# Altium schematic sheet MCU & Peripherals.SchDoc: STM32 Blue Pill
size A3; ApprovedBy: Bui Quoc Bao; SheetNumber: 3; SheetTotal: 4; SPICEModelCacheVQOZSIKY: <root> / <DocumentId>VQOZSIKY</DocumentId> / <CacheFrame Number="0"> / <Model Name="0805_885012207072_100nf" Kind="CKT"> / <Text>******* / .subckt 0805_885012207072_100nF 1 2 / Rser 1 3 0.0172819633028 / Lser 2 4 0.00000000035 / C1 3 4 0.0000001 / Rpar 3 4 5000000000 / .ends 0805_885012207072_100nF</Text> / </Model> / </CacheFrame> / </root>
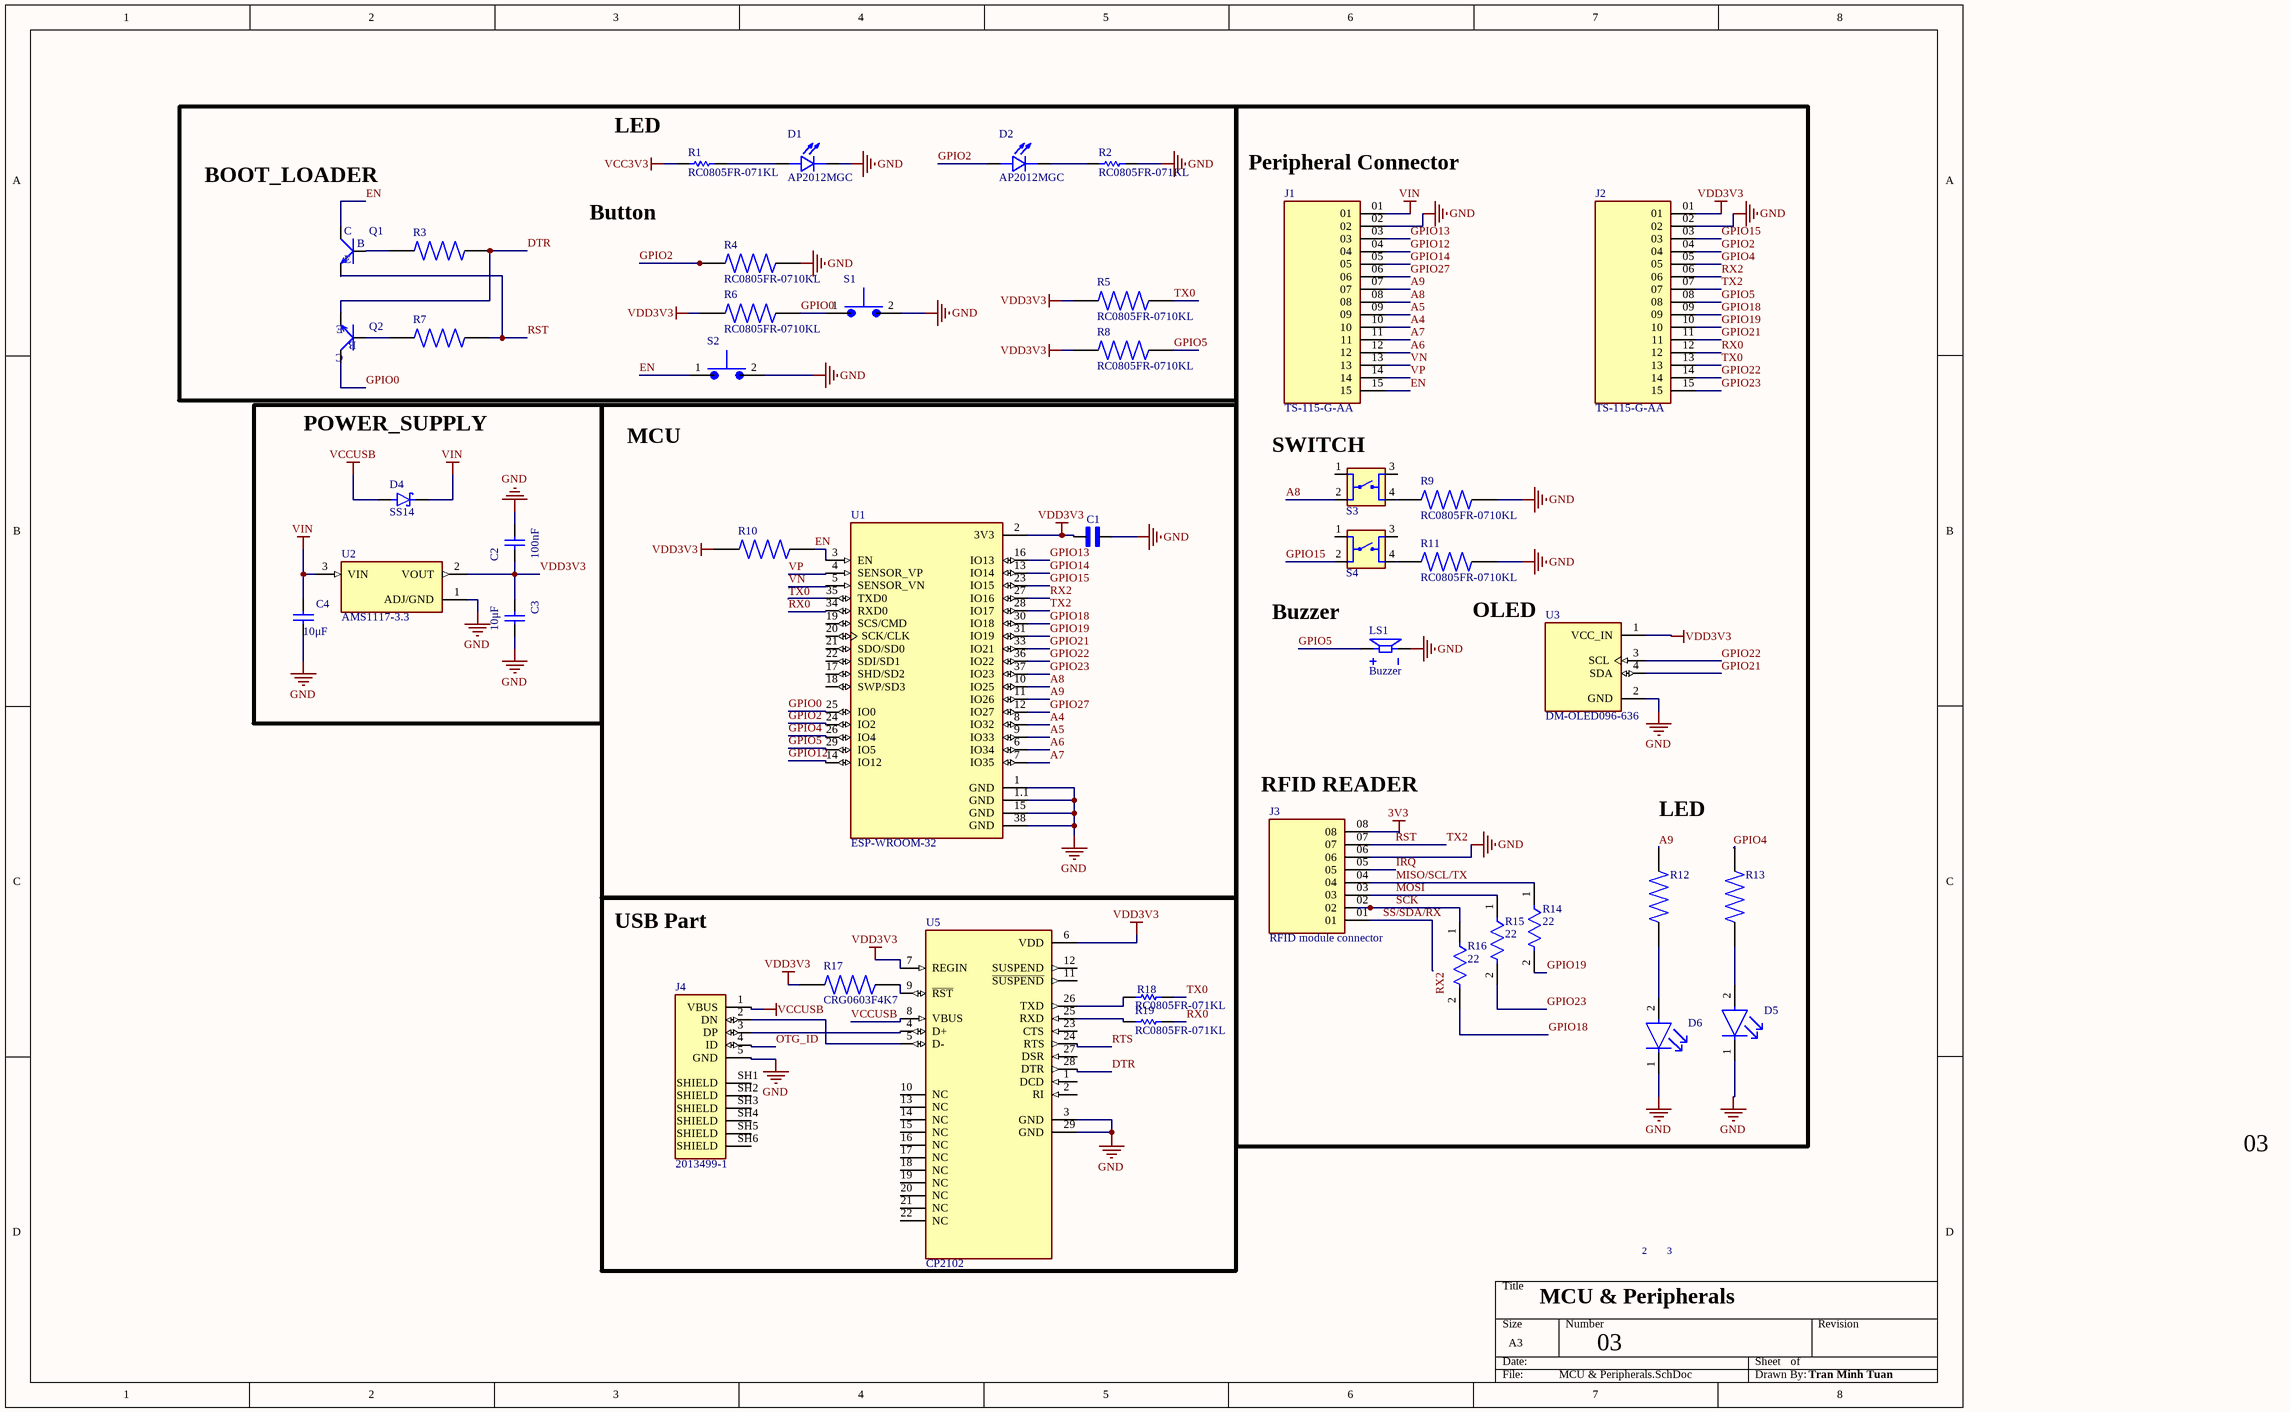
[diagram p0: MCU & Peripherals.SchDoc]

## Parts
C1  GRM32EC70J107ME15L  [CAPC3225X270N]  (value not drawn)
C2  100nF  [WCAP-CSGP_0805_L2W1.25H0.8_Reflow]
C3  10μF  [WCAP-CSGP_0805_L2W1.25H1.25]
C4  10μF  [WCAP-CSGP_0805_L2W1.25H1.25]
D1  AP2012MGC  [LED_AP2012MGC]
D2  AP2012MGC  [LED_AP2012MGC]
D4  SS14  [DIOM4325X250N]
D5  HLMP-1719  [FP-HLMP-1719-MFG]  (value not drawn)
D6  HLMP-1719  [FP-HLMP-1719-MFG]  (value not drawn)
J1  TS-115-G-AA  [SAMTEC_TS-115-G-AA]
J2  TS-115-G-AA  [SAMTEC_TS-115-G-AA]
J3  RFID module connector  [SAMTEC_SL-108-T-19]
J4  2013499-1  [TE_2013499-1]
LS1  Buzzer  [XDCR_CMI-1210-5-95T]
Q1  SMD-TRANSISTORS-NPN-25V-500MW(SOT-23)  [SOT-23]  (value not drawn)
Q2  SMD-TRANSISTORS-NPN-25V-500MW(SOT-23)  [SOT-23]  (value not drawn)
R1  RC0805FR-071KL  [RESC2013X60X35NL10T20]
R2  RC0805FR-071KL  [RESC2013X60X35NL10T20]
R3  RC0805FR-0710KL  [RESC2012X60N]  (value not drawn)
R4  RC0805FR-0710KL  [RESC2012X60N]
R5  RC0805FR-0710KL  [RESC2012X60N]
R6  RC0805FR-0710KL  [RESC2012X60N]
R7  RC0805FR-0710KL  [RESC2012X60N]  (value not drawn)
R8  RC0805FR-0710KL  [RESC2012X60N]
R9  RC0805FR-0710KL  [RESC2012X60N]
R10  RC0805FR-0710KL  [RESC2012X60N]  (value not drawn)
R11  RC0805FR-0710KL  [RESC2012X60N]
R12  ERJPA3F5100V  [RES_ERJPA3F5100V]  (value not drawn)
R13  ERJPA3F5100V  [RES_ERJPA3F5100V]  (value not drawn)
R14  22  [FP-ERJ3G-MFG]
R15  22  [FP-ERJ3G-MFG]
R16  22  [FP-ERJ3G-MFG]
R17  CRG0603F4K7  [RESC1608X55N]
R18  RC0805FR-071KL  [RESC2013X60X35NL10T20]
R19  RC0805FR-071KL  [RESC2013X60X35NL10T20]
S1  TS10-63-26-BE-250-SMT-TR  [SW_TS10-63-26-BE-250-SMT-TR]  (value not drawn)
S2  TS10-63-26-BE-250-SMT-TR  [SW_TS10-63-26-BE-250-SMT-TR]  (value not drawn)
S3  FSM8JH  [SW_FSM8JH]  (value not drawn)
S4  FSM8JH  [SW_FSM8JH]  (value not drawn)
U1  ESP-WROOM-32  [MODULE_ESP-WROOM-32]
U2  AMS1117-3.3  [SOT229P700X180-4N]
U3  DM-OLED096-636  [MODULE_DM-OLED096-636]
U5  CP2102  [QFN50P500X500X100-29N]

## Blocks framed on the sheet
POWER_SUPPLY: C2-C4 D4 U2
MCU: C1 R10 U1
USB Part: J4 R17-R19 U5

## Nets
3V3: J3.08
GND: C1.2 C2.2 C3.2 C4.2 D1.C D5.1(C) D6.1(C) J1.02 J2.02 J3.06 J4.5(GND) LS1.N R2.2 R4.2 R9.1 R11.1 S1.2 S2.2 U1.1(GND) U1.1.1(GND) U1.15(GND) U1.38(GND) U2.1(ADJ/GND) U3.2(GND) U5.3(GND) U5.29(GND)
VCC3V3: R1.1
VCCUSB: D4.A J4.1(VBUS) U5.8(VBUS)
VDD3V3: C1.1 C2.1 C3.1 J2.01 R5.1 R6.1 R8.1 R10.1 R17.1 U1.2(3V3) U2.2(VOUT) U3.1(VCC_IN) U5.6(VDD) U5.7(REGIN)
VIN: C4.1 D4.C(K) J1.01 U2.3(VIN)
A4: J1.10 U1.8(IO32)
A5: J1.09 U1.9(IO33)
A6: J1.12 U1.6(IO34)
A7: J1.11 U1.7(IO35)
A8: J1.08 S3.2 U1.10(IO25)
A9: J1.07 R12.1 U1.11(IO26)
DTR: Q2.2(E) R3.2 U5.28(DTR)
EN: J1.15 Q1.3(C) R10.2 S2.1 U1.3(EN)
GPIO0: Q2.3(C) R6.2 S1.1 U1.25(IO0)
GPIO2: D2.A J2.04 R4.1 U1.24(IO2)
GPIO4: J2.05 R13.1 U1.26(IO4)
GPIO5: J2.08 LS1.P R8.2 U1.29(IO5)
GPIO12: J1.04 U1.14(IO12)
GPIO13: J1.03 U1.16(IO13)
GPIO14: J1.05 U1.13(IO14)
GPIO15: J2.03 S4.2 U1.23(IO15)
GPIO18: J2.09 R16.2 U1.30(IO18)
GPIO19: J2.10 R14.2 U1.31(IO19)
GPIO21: J2.11 U1.33(IO21) U3.4(SDA)
GPIO22: J2.14 U1.36(IO22) U3.3(SCL)
GPIO23: J2.15 R15.2 U1.37(IO23)
GPIO27: J1.06 U1.12(IO27)
IRQ: J3.05
MISO/SCL/TX: J3.04 R14.1
MOSI: J3.03 R15.1
OTG_ID: J4.4(ID)
RST: J2.07 J3.07 Q1.2(E) R7.2 U1.28(IO17)  [also labelled TX2]
RTS: U5.24(RTS)
RX0: J2.12 R19.2 U1.34(RXD0)
RX2: J2.06 J3.01 U1.27(IO16)  [also labelled SS/SDA/RX]
SCK: J3.02 R16.1
TX0: J2.13 R5.2 R18.2 U1.35(TXD0)
VN: J1.13 U1.5(SENSOR_VN)
VP: J1.14 U1.4(SENSOR_VP)
NetD1_A: D1.A R1.2
NetD2_C: D2.C R2.1
NetD5_2: D5.2(A) R13.2
NetD6_2: D6.2(A) R12.2
NetJ4_2: J4.2(DN) U5.5(D-)
NetJ4_3: J4.3(DP) U5.4(D+)
NetQ1_1: Q1.1(B) R3.1
NetQ2_1: Q2.1(B) R7.1
NetR9_2: R9.2 S3.4
NetR11_2: R11.2 S4.4
NetR17_2: R17.2 U5.9(~{RST})
NetR18_1: R18.1 U5.26(TXD)
NetR19_1: R19.1 U5.25(RXD)

Not connected (* = marked no-connect by the designer): J4 SH1(SHIELD) SH2(SHIELD) SH3(SHIELD) SH4(SHIELD) SH5(SHIELD) SH6(SHIELD); S3 1 3; S4 1 3; U1 17(SHD/SD2) 18(SWP/SD3) 19(SCS/CMD) 20(SCK/CLK) 21(SDO/SD0) 22(SDI/SD1); U5 1(DCD) 2(RI) 10(NC) 11(~{SUSPEND}) 12(SUSPEND) 13(NC) 14(NC) 15(NC) 16(NC) 17(NC) 18(NC) 19(NC) 20(NC) 21(NC) 22(NC) 23(CTS) 27(DSR)

## Notes on the sheet
- (near R1) LED
- BOOT_LOADER
- (near R1) Button
- (near J1) Peripheral Connector
- (near S3) SWITCH
- Buzzer
- (near R11) OLED
- (near J3) RFID READER
- LED
- 03
- MCU & Peripherals
- 2
- 3
- Tran Minh Tuan

## Library data of the parts
C1 = GRM32EC70J107ME15L: SMD capacitor X7S(EIA) with capacitance 100uF Tol.20%. Rated voltage 6.3Vdc 125C; MF: Murata Electronics; SnapEDA_Link: https://www.snapeda.com/parts/GRM32EC70J107ME15L/Murata+Electronics+North+America/view-part/?ref=snap; Package: 3225 Murata; Value: *; MP: GRM32EC70J107ME15L; Check_prices: https://www.snapeda.com/parts/GRM32EC70J107ME15L/Murata+Electronics+North+America/view-part/?ref=eda
C2 = 885012207072: WCAP-CSGP Multilayer Ceramic Chip Capacitor, General Purpose, size 0805, X7R, 100nF, 25V; Manufacturer: Wurth Elektronik; Case/Size Code: 0805; Capacitance Tolerance: +/-10%; Dissipation Factor: 3.5%; Insulation Resistance: 5GΩ; Technical Reference: X7R0805104K025DFCT10000; Manufacturer Part Number: 885012207072; Category: Multilayer Ceramic Chip Capacitors; Match Code: WCAP-CSGP; ComponentLink1Description: Website Link; ComponentLink1URL: https://www.we-online.com/redexpert/article/885012207072?ad; ComponentLink2Description: Datasheet Link; ComponentLink2URL: https://www.we-online.com/redexpert/spec/885012207072?ad; Mount: Surface Mount; Min Operating Temperature: -55°C; Max Operating Temperature: 125°C; Packaging: Tape and Reel; Length: 2mm; Width: 1.25mm; Height: 0.8mm; Capacitance: 100nF; Ceramic Type: X7R; Rated Voltage (DC): 25V
C3 C4 = 885012107027: WCAP-CSGP Multilayer Ceramic Chip Capacitor, General Purpose, size 0805, X5R Class II, 10μF, 25V; Manufacturer: Wurth Elektronik; Case/Size Code: 0805; Capacitance Tolerance: +/-10%; Dissipation Factor: 12.5%; Insulation Resistance: 0.005GΩ; Technical Reference: X5R0805106K025DFCT10000; Manufacturer Part Number: 885012107027; Category: Multilayer Ceramic Chip Capacitors; Match Code: WCAP-CSGP; ComponentLink1Description: Website Link; ComponentLink1URL: https://www.we-online.com/redexpert/article/885012107027?ad; ComponentLink2Description: Datasheet Link; ComponentLink2URL: https://www.we-online.com/redexpert/spec/885012107027?ad; Mount: Surface Mount; Min Operating Temperature: -55°C; Max Operating Temperature: 85°C; Packaging: Tape and Reel; Length: 2mm; Width: 1.25mm; Height: 1.25mm; Capacitance: 10μF; Ceramic Type: X5R Class II; Rated Voltage (DC): 25V
D1 D2 = AP2012MGC: Green 2 x 1.25 x 1.1 mm 120Â° Water Clear 70 mcd 2.1 V Chip LED Lamp SMT; MF: Kingbright; SnapEDA_Link: https://www.snapeda.com/parts/AP2012MGC/Kingbright/view-part/?ref=snap; Package: 0805 Kingbright; Value: *; MP: AP2012MGC; Check_prices: https://www.snapeda.com/parts/AP2012MGC/Kingbright/view-part/?ref=eda
D4 = SS14: 1A, 40V, Schottky Rectifier; MF: Taiwan Semiconductor; SnapEDA_Link: https://www.snapeda.com/parts/SS14/taiwan/view-part/?ref=snap; Package: SMA-2 Taiwan Semiconductor; Value: *; MP: SS14; Check_prices: https://www.snapeda.com/parts/SS14/taiwan/view-part/?ref=eda
D5 D6 = CMP-2000-06410-2: LED YELLOW DIFFUSED T-1 T/H; Manufacturer: Broadcom; Wavelength: 585nm; Led Orientation: Straight; Luminous Intensity: 2.1mcd; Forward Voltage: 1.8V; Viewing Angle: 50°; Reverse Voltage: 5V; Power Dissipation: 17.5mW; Forward Current: 2mA; Lead Free: Yes; Automotive: No; Device Class L1: Optoelectronics; Mouser Description: Standard LEDs - Through Hole Yellow Diffused 585nm 2.1mcd; Digikey Description: LED YELLOW DIFFUSED T-1 T/H; Temperature: -40°C to +100°C; Temperature Range High: +100°C; Package: 0; Category: Diode; Colour: Yellow; Device Class L2: LEDs; ComponentLink2Description: Datasheet; ComponentLink2URL: https://docs.broadcom.com/docs/AV02-1557EN; Temperature Range Low: -40°C; Device Class L3: unset; Octopart: https://octopart.com/hlmp-1719-broadcom-71130405; RoHS: TRUE; Manufacturer Part Number: HLMP-1719
J1 J2 = TS-115-G-AA: MF: Samtec; Value: *; MP: TS-115-G-AA; Availability: Unavailable; Package: None; Price: None
J3 = SL-108-T-19: Package: None; Price: None; Value: *; MP: SL-108-T-19; Availability: Unavailable
LS1 = CMI-1210-5-95T: MP: CMI-1210-5-95T; Availability: Unavailable; Package: None; Value: *; Price: None
Q1 Q2 = SMD-TRANSISTORS-NPN-25V-500MW(SOT-23): Bipolar (BJT) Transistor NPN 25 V 500 mA 150MHz 300 mW Surface Mount SOT-23; MF: UMW; MP: S8050; Purchase-URL: https://pricing.snapeda.com/search/part/S8050/?ref=eda; Check_prices: https://www.snapeda.com/parts/S8050/Umwelt+Sensor+Teknik/view-part/?ref=eda; SnapEDA_Link: https://www.snapeda.com/parts/S8050/Umwelt+Sensor+Teknik/view-part/?ref=snap; Price: None; Availability: In Stock; Package: None; Value: *
R1 R2 R18 R19 = CMP-2100-03671-1: Chip Resistor, 1 KOhm, +/- 1%, 125 mW, -55 to 155 degC, 0805 (2012 Metric), RoHS, Tape and Reel; Manufacturer: Yageo; Temperature Coefficient: 100ppm/degreesC; Voltage Rating (DC): 150V; Max Power Dissipation: 125mW; Resistance: 1KOhm; Number of Pins: 2; Number of Terminations: 2; Datasheet URL: http://www.yageo.com/NewPortal/yageodocoutput?fileName=/pdf/R-Chip/PYu-RC_Group_51_RoHS_L_5.pdf; Length: 0.079inch; Package Description: 2-Pin Surface Mounted Device, Body 2 x 1.25 mm; Depth: 1.25mm; Height: 0.024inch; Military Standard: Not; Case/Package: 0805; Package Reference: 0805; RoHSCompliant: true; Lead Free: LeadFree; Packaging: TapeandReel; Package Quantity: 1; Datasheet Version: Rev. 5, 10/2016; Tolerance: 1%; Min Operating Temperature: -55degC; Voltage Rating: 150V; Composition: ThickFilm; Case Code (Imperial): 0805; Power Rating: 125mW; Width: 0.049inch; Case Code (Metric): 2012; Manufacturer URL: http://www.yageo.com/; Max Operating Temperature: 155degC; REACH SVHC: Unknown; Termination: SMD/SMT
R3-R11 = RC0805FR-0710KL: 10 kOhms Â±1% 0.125W, 1/8W Chip Resistor 0805 (2012 Metric) Moisture Resistant Thick Film; MF: Yageo; Value: *; SnapEDA_Link: https://www.snapeda.com/parts/RC0805FR-0710KL/Yageo/view-part/?ref=snap; Purchase-URL: https://pricing.snapeda.com/search/part/RC0805FR-0710KL/?ref=eda; Availability: In Stock; Price: None; Package: 2012 Rohm Semiconductor; Check_prices: https://www.snapeda.com/parts/RC0805FR-0710KL/Yageo/view-part/?ref=eda; MP: RC0805FR-0710KL
R12 R13 = ERJPA3F5100V: RES, THICK FILM, 510R, 1%, 0.25W, 0603; MF: Panasonic; MP: ERJ-PA3F5100V; SnapEDA_Link: https://www.snapeda.com/parts/ERJ-PA3F5100V/Panasonic/view-part/?ref=snap; Package: 1608-2 Panasonic; Value: *; Check_prices: https://www.snapeda.com/parts/ERJ-PA3F5100V/Panasonic/view-part/?ref=eda
R14-R16 = CMP-2000-00745-2: RES SMD 22 OHM 5% 1/10W 0603; Voltage Rating: 75V; Temperature Coefficient: 200ppm/°C; Resistance: 22R; Power Rating: 100mW; Voltage Rating (DC): 50V; Case Code (Metric): 1608; Resistance Tolerance: 5%; RoHS Compliant: Yes; Series: ERJ; Tolerance: 5%; Package Quantity: 1; Depth: 0.8mm; Width: 0.031inch; Technology: THICK FILM; Number of Terminations: 2; Packaging: Tape and Reel; Height: 0.45mm; Max Operating Temperature: 155°C; Min Operating Temperature: -55°C; Termination: SMD/SMT; Radiation Hardening: No; Military Standard: Not; Case Code (Imperial): 0603; Contact Plating: Tin; Resistor Type: Thick Film; Construction: Rectangular; REACH SVHC: No SVHC; Case/Package: 0603; Lead Free: Lead Free; Features: Automotive AEC-Q200; Length: 1.6mm; Max Power Dissipation: 100mW; Mount: Surface Mount
R17 = CRG0603F4K7: Resistor, Thick Film, Res 4.7 Kilohms, Pwr-Rtg 0.1 W, Tol 1%, SMT, 0603 | TE Connectivity CRG0603F4K7; Power_Rating: .1 W; Resistance: 4.7K; Voltage_Rating: 50 V; SnapEDA_Link: https://www.snapeda.com/parts/CRG0603F4K7/TE+Connectivity+Passive+Product/view-part/?ref=snap; Package: 0603; Value: *; MF: TE Connectivity; MP: CRG0603F4K7; EU_RoHS_Compliance: Compliant with Exemptions; Tolerance: 1%; Check_prices: https://www.snapeda.com/parts/CRG0603F4K7/TE+Connectivity+Passive+Product/view-part/?ref=eda
S1 S2 = TS10-63-26-BE-250-SMT-TR: 6.1 x 3.8 mm, 2.6 mm Actuator Height, 250 gf, Surface Mount, SPST, Tactile Switch; MF: Same Sky; SnapEDA_Link: https://www.snapeda.com/parts/TS10-63-26-BE-250-SMT-TR/Same+Sky/view-part/?ref=snap; Package: None; Value: *; MP: TS10-63-26-BE-250-SMT-TR; Check_prices: https://www.snapeda.com/parts/TS10-63-26-BE-250-SMT-TR/Same+Sky/view-part/?ref=eda
S3 S4 = FSM8JH: Tactile Switch SPST-NO Top Actuated Through Hole; MF: TE Connectivity; Check_prices: https://www.snapeda.com/parts/FSM8JH/TE+Connectivity+ALCOSWITCH+Switches/view-part/?ref=eda; Value: *; Availability: In Stock; MP: FSM8JH; Price: None; Package: None; SnapEDA_Link: https://www.snapeda.com/parts/FSM8JH/TE+Connectivity+ALCOSWITCH+Switches/view-part/?ref=snap
U1 = ESP-WROOM-32: Transceptor serie ESP-WROOM-32; Placa de evaluaciÃ³n 802.11 b/g/n (Wi-Fi, WiFi, WLAN), BluetoothÂ® Smart 4.x de bajo consumo (BLE); MF: Espressif Systems; SnapEDA_Link: https://www.snapeda.com/parts/ESP-WROOM-32/Espressif+Systems/view-part/?ref=snap; Package: Module Espressif Systems; Value: *; MP: ESP-WROOM-32; Check_prices: https://www.snapeda.com/parts/ESP-WROOM-32/Espressif+Systems/view-part/?ref=eda
U2 = AMS1117-3.3: Linear Voltage Regulator IC Positive Fixed 1 Output 1A SOT-223-3L; MF: UMW; SnapEDA_Link: https://www.snapeda.com/parts/AMS1117-3.3/UMW/view-part/?ref=snap; Package: SOT-223-3L UMW; Value: *; MP: AMS1117-3.3; Check_prices: https://www.snapeda.com/parts/AMS1117-3.3/UMW/view-part/?ref=eda
U3 = DM-OLED096-636: 0.96â€ 128 X 64 MONOCHROME GRAPHIC OLED DISPLAY MODULE - I2C; SnapEDA_Link: https://www.snapeda.com/parts/DM-OLED096-636/Display+Module/view-part/?ref=snap; Package: Package; Value: *; MF: Display Module; MP: DM-OLED096-636; Check_prices: https://www.snapeda.com/parts/DM-OLED096-636/Display+Module/view-part/?ref=eda
U5 = CP2102: CP2102N USB 2.0 to UART (RS232) Bridge Interface Evaluation Board; MF: Silicon Labs; Purchase-URL: https://pricing.snapeda.com/search/part/CP2102/?ref=eda; Package: WFQFN-20 Silicon Labs; Value: *; Check_prices: https://www.snapeda.com/parts/CP2102/Silicon+Labs/view-part/?ref=eda; SnapEDA_Link: https://www.snapeda.com/parts/CP2102/Silicon+Labs/view-part/?ref=snap; Availability: In Stock; Price: None; MP: CP2102
J4 = 2013499-1: Package: None; Price: None; Value: *; MP: 2013499-1; Availability: Unavailable